# EAGLE design uStar (EAGLE 9.6.2)

## Sheet 1 of 3: Connections
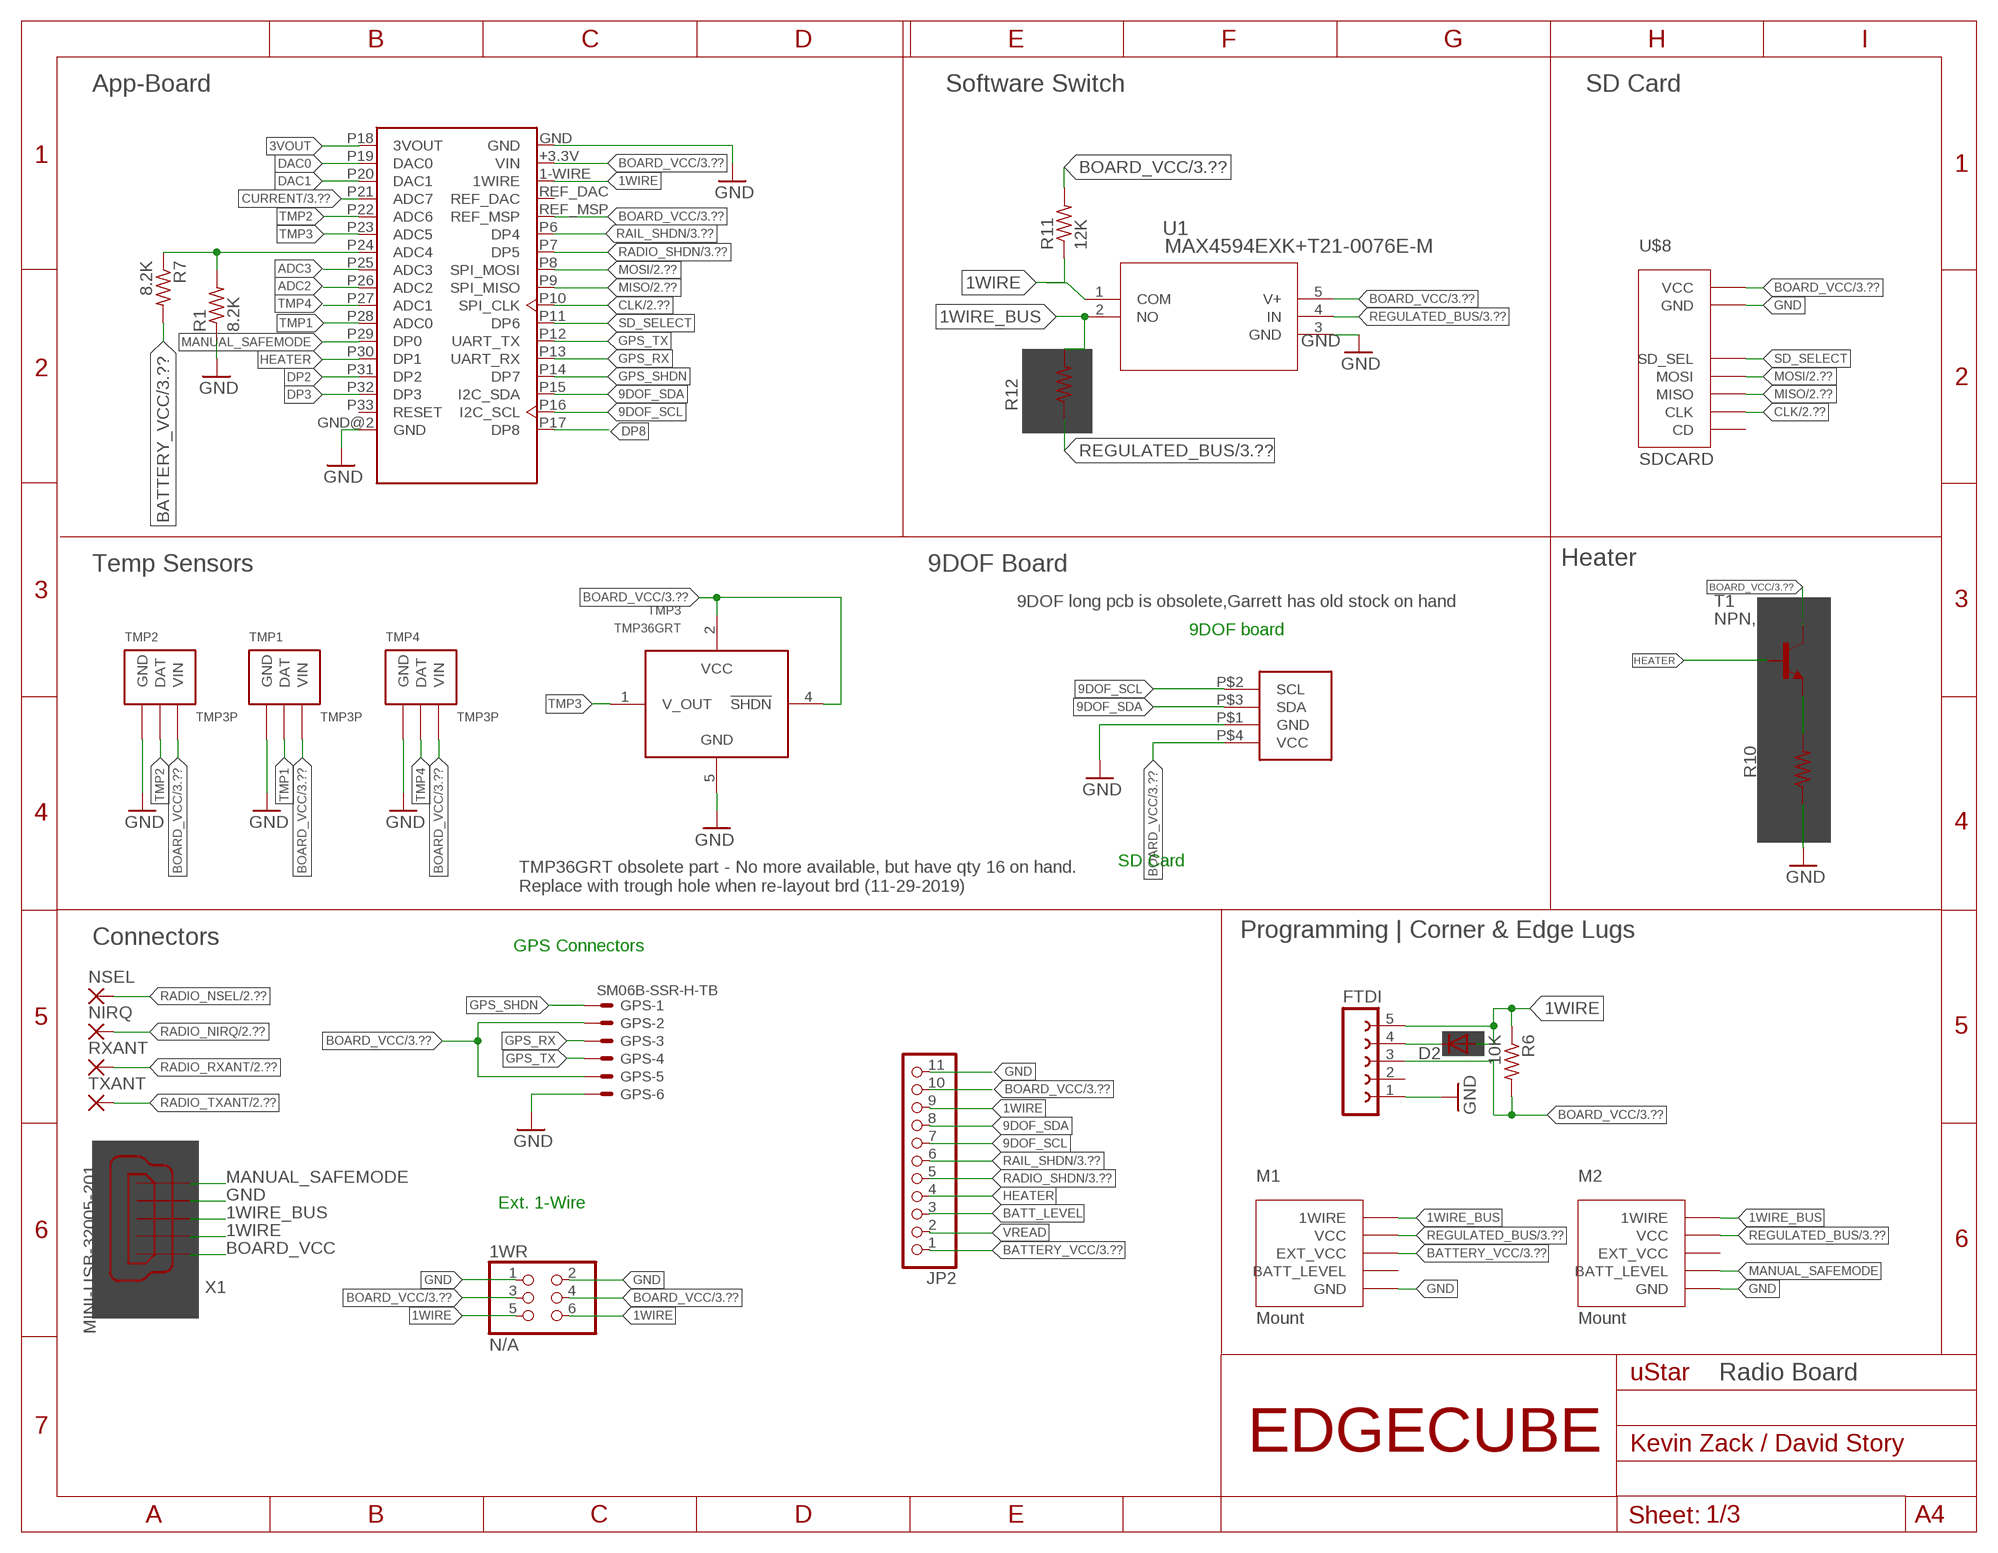
[diagram p0: schematic, sheet 1]
FRAME2 (SSEL_SHEET_A3): AUTHOR: Kevin Zack / David Story; SHEET_NAME: Connections

### Parts
1WR  N/A  PINHD-2X3  [2X03]
D2  D-B260A  [SMA-DO214AC]
FTDI  FE05-1  [FE05-1]
GPS  SM06B-SSR-H-TB  [SM06B-SSR-H-TB]
JP2  PINHD-1X11  [1X11]
M1  Mount  4X8MOUNT  [4X8MOUNT]
M2  Mount  4X8MOUNT  [4X8MOUNT]
NIRQ  1,6/0,9  [1,6/0,9]
NSEL  1,6/0,9  [1,6/0,9]
PCB1  9DOF  [9DOF]
R1  8.2K  R-US_R0805  [R0805]
R6  10K  RES-0603-10K  [R0603]
R7  8.2K  R-US_R0805  [R0805]
R10  22  R-US_0207/7  [0207/7]
R11  12K  R-US_R0805  [R0805]
R12  NP  R-US_R0805  [R0805]
RXANT  1,6/0,9  [1,6/0,9]
T1  NPN, 0.25A  2N2222  [TO92-EBC-OVAL]
TMP1  TMP3P  [TMP3P]
TMP2  TMP3P  [TMP3P]
TMP3  TMP36GRT  [SOT-23-5]
TMP4  TMP3P  [TMP3P]
TXANT  1,6/0,9  [1,6/0,9]
U1  MAX4594EXK+T21-0076E-M  [21-0076E-M]
U$1  App-Board 1.2/1.3  APP_CORE  [APPCORE_RECEIVER]
U$8  SDCARD  [SDCARD]
X1  MINI-USB-32005-201  [32005-201]

### Nets
1WIRE: 1WR.5 1WR.6 D2.A FTDI.5 JP2.9 R6.1 R11.1 U1.1(COM) U$1.1-WIRE(1WIRE) X1.2
1WIRE_BUS: M1.P$2(1WIRE) M1.P$5(1WIRE) M2.P$2(1WIRE) M2.P$5(1WIRE) R12.2 U1.2(NO) X1.3
3VOUT: U$1.P18(3VOUT)
9DOF_SCL: JP2.7 PCB1.P$2(SCL) U$1.P16(I2C_SCL)
9DOF_SDA: JP2.8 PCB1.P$3(SDA) U$1.P15(I2C_SDA)
ADC2: U$1.P26(ADC2)
ADC3: U$1.P25(ADC3)
BATT_LEVEL: JP2.3
BATTERY_VCC: JP2.1 M1.P$3(EXT_VCC) R7.2 ; also sheet 3
BOARD_VCC: 1WR.3 1WR.4 FTDI.3 GPS.2 GPS.5 JP2.10 PCB1.P$4(VCC) R6.2 R11.2 T1.C TMP1.P$3(VIN) TMP2.P$3(VIN) TMP3.2(VCC) TMP3.4(!SHDN) TMP4.P$3(VIN) U1.5(V+) U$1.+3.3V(VIN) U$1.REF_MSP U$8.P$3(VCC) X1.1 ; also sheet 3
CLK: U$1.P10(SPI_CLK) U$8.P$4(CLK) ; also sheet 2
CURRENT: U$1.P21(ADC7) ; also sheet 3
DAC0: U$1.P19(DAC0)
DAC1: U$1.P20(DAC1)
DP2: U$1.P31(DP2)
DP3: U$1.P32(DP3)
DP8: U$1.P17(DP8)
GND: 1WR.1 1WR.2 FTDI.1 GPS.6 JP2.11 M1.P$1(GND) M1.P$8(GND) M2.P$1(GND) M2.P$8(GND) PCB1.P$1(GND) R1.1 R10.1 TMP1.P$1(GND) TMP2.P$1(GND) TMP3.5(GND) TMP4.P$1(GND) U1.3(GND) U$1.GND U$1.GND@2(GND) U$8.P$5(GND) X1.4 ; also sheet 2,3
GPS_RX: GPS.3 U$1.P13(UART_RX)
GPS_SHDN: GPS.1 U$1.P14(DP7)
GPS_TX: GPS.4 U$1.P12(UART_TX)
HEATER: JP2.4 T1.B U$1.P30(DP1)
MANUAL_SAFEMODE: M2.P$6(BATT_LEVEL) U$1.P29(DP0) X1.5
MISO: U$1.P9(SPI_MISO) U$8.P$6(MISO) ; also sheet 2
MOSI: U$1.P8(SPI_MOSI) U$8.P$2(MOSI) ; also sheet 2
N$1: R1.2 R7.1 U$1.P24(ADC4)
N$2: R10.2 T1.E
N$3: D2.K(C) FTDI.4
N$7: U$1.P33(RESET)
RADIO_NIRQ: NIRQ.1(P) ; also sheet 2
RADIO_NSEL: NSEL.1(P) ; also sheet 2
RADIO_RXANT: RXANT.1(P) ; also sheet 2
RADIO_SHDN: JP2.5 U$1.P7(DP5) ; also sheet 3
RADIO_TXANT: TXANT.1(P) ; also sheet 2
RAIL_SHDN: JP2.6 U$1.P6(DP4) ; also sheet 3
REGULATED_BUS: M1.P$4(VCC) M1.P$7(VCC) M2.P$4(VCC) M2.P$7(VCC) R12.1 U1.4(IN) ; also sheet 3
SD_SELECT: U$1.P11(DP6) U$8.P$1(SD_SEL)
TMP1: TMP1.P$2(DAT) U$1.P28(ADC0)
TMP2: TMP2.P$2(DAT) U$1.P22(ADC6)
TMP3: TMP3.1(V_OUT) U$1.P23(ADC5)
TMP4: TMP4.P$2(DAT) U$1.P27(ADC1)
VREAD: JP2.2
Unconnected: FTDI.2 M1.P$6(BATT_LEVEL) M2.P$3(EXT_VCC) U$1.REF_DAC U$8.P$7(CD)

### Notes on the sheet
- App-Board | Software Switch | SD Card
- Temp Sensors | 9DOF Board | Heater
- 9DOF long pcb is obsolete,Garrett has old stock on hand
- 9DOF board
- SD Card
- TMP36GRT obsolete part - No more available, but have qty 16 on hand.
  Replace with trough hole when re-layout brd (11-29-2019)
- Connectors | Programming | Corner & Edge Lugs
- GPS Connectors
- Ext. 1-Wire
- Radio Board

## Sheet 2 of 3: Radio
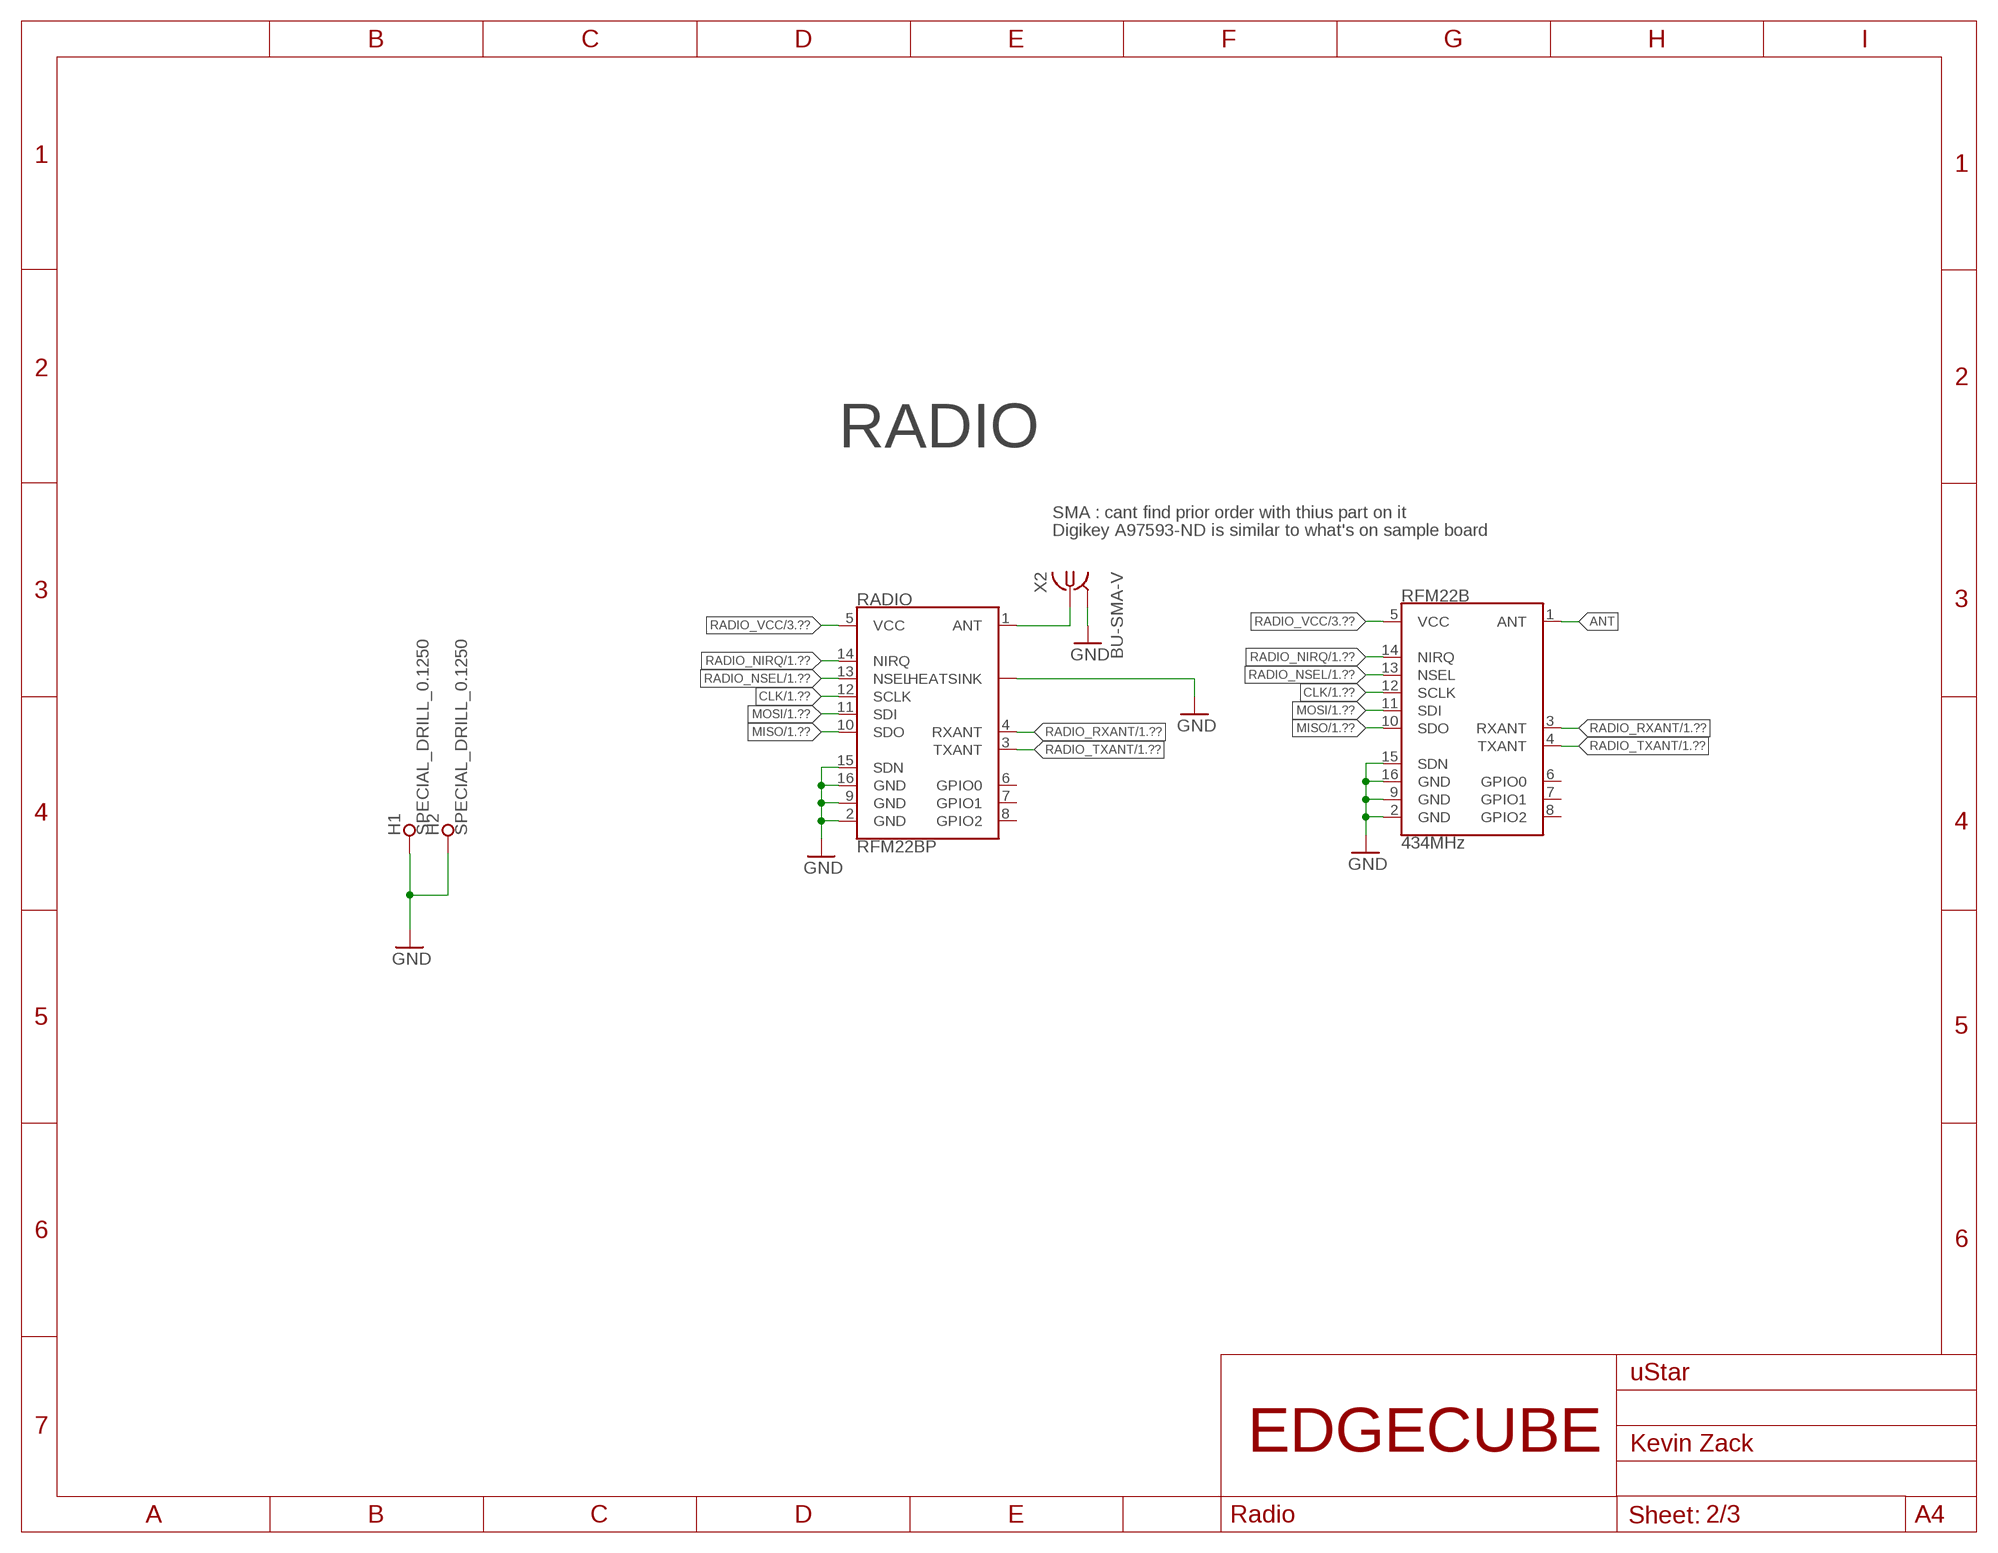
[diagram p1: schematic, sheet 2]
FRAME1 (SSEL_SHEET_A3): AUTHOR: Kevin Zack; SHEET_NAME: Radio

### Parts
H1  SPECIAL_DRILL_0.1250  [PAD_0.1250]
H2  SPECIAL_DRILL_0.1250  [PAD_0.1250]
RADIO  RFM22BP  [RFM22BP]
RFM22B  434MHz  RFM22434MHZ  [RFM22-XXX-S2]
X2  BU-SMA-V  [BU-SMA-V]

### Nets
ANT: RADIO.1(ANT) RFM22B.1(ANT) X2.1
CLK: RADIO.12(SCLK) RFM22B.12(SCLK) ; also sheet 1
GND: H1.1 H2.1 RADIO.2(GND) RADIO.9(GND) RADIO.15(SDN) RADIO.16(GND) RADIO.P$1(HEATSINK) RFM22B.2(GND) RFM22B.9(GND) RFM22B.15(SDN) RFM22B.16(GND) X2.2 X2.3 X2.4 X2.5 ; also sheet 1,3
MISO: RADIO.10(SDO) RFM22B.10(SDO) ; also sheet 1
MOSI: RADIO.11(SDI) RFM22B.11(SDI) ; also sheet 1
RADIO_NIRQ: RADIO.14(NIRQ) RFM22B.14(NIRQ) ; also sheet 1
RADIO_NSEL: RADIO.13(NSEL) RFM22B.13(NSEL) ; also sheet 1
RADIO_RXANT: RADIO.4(RXANT) RFM22B.3(RXANT) ; also sheet 1
RADIO_TXANT: RADIO.3(TXANT) RFM22B.4(TXANT) ; also sheet 1
RADIO_VCC: RADIO.5(VCC) RFM22B.5(VCC) ; also sheet 3
Unconnected: RADIO.6(GPIO0) RADIO.7(GPIO1) RADIO.8(GPIO2) RFM22B.6(GPIO0) RFM22B.7(GPIO1) RFM22B.8(GPIO2)

### Notes on the sheet
- RADIO
- SMA : cant find prior order with thius part on it
- Digikey A97593-ND is similar to what's on sample board

## Sheet 3 of 3: Power
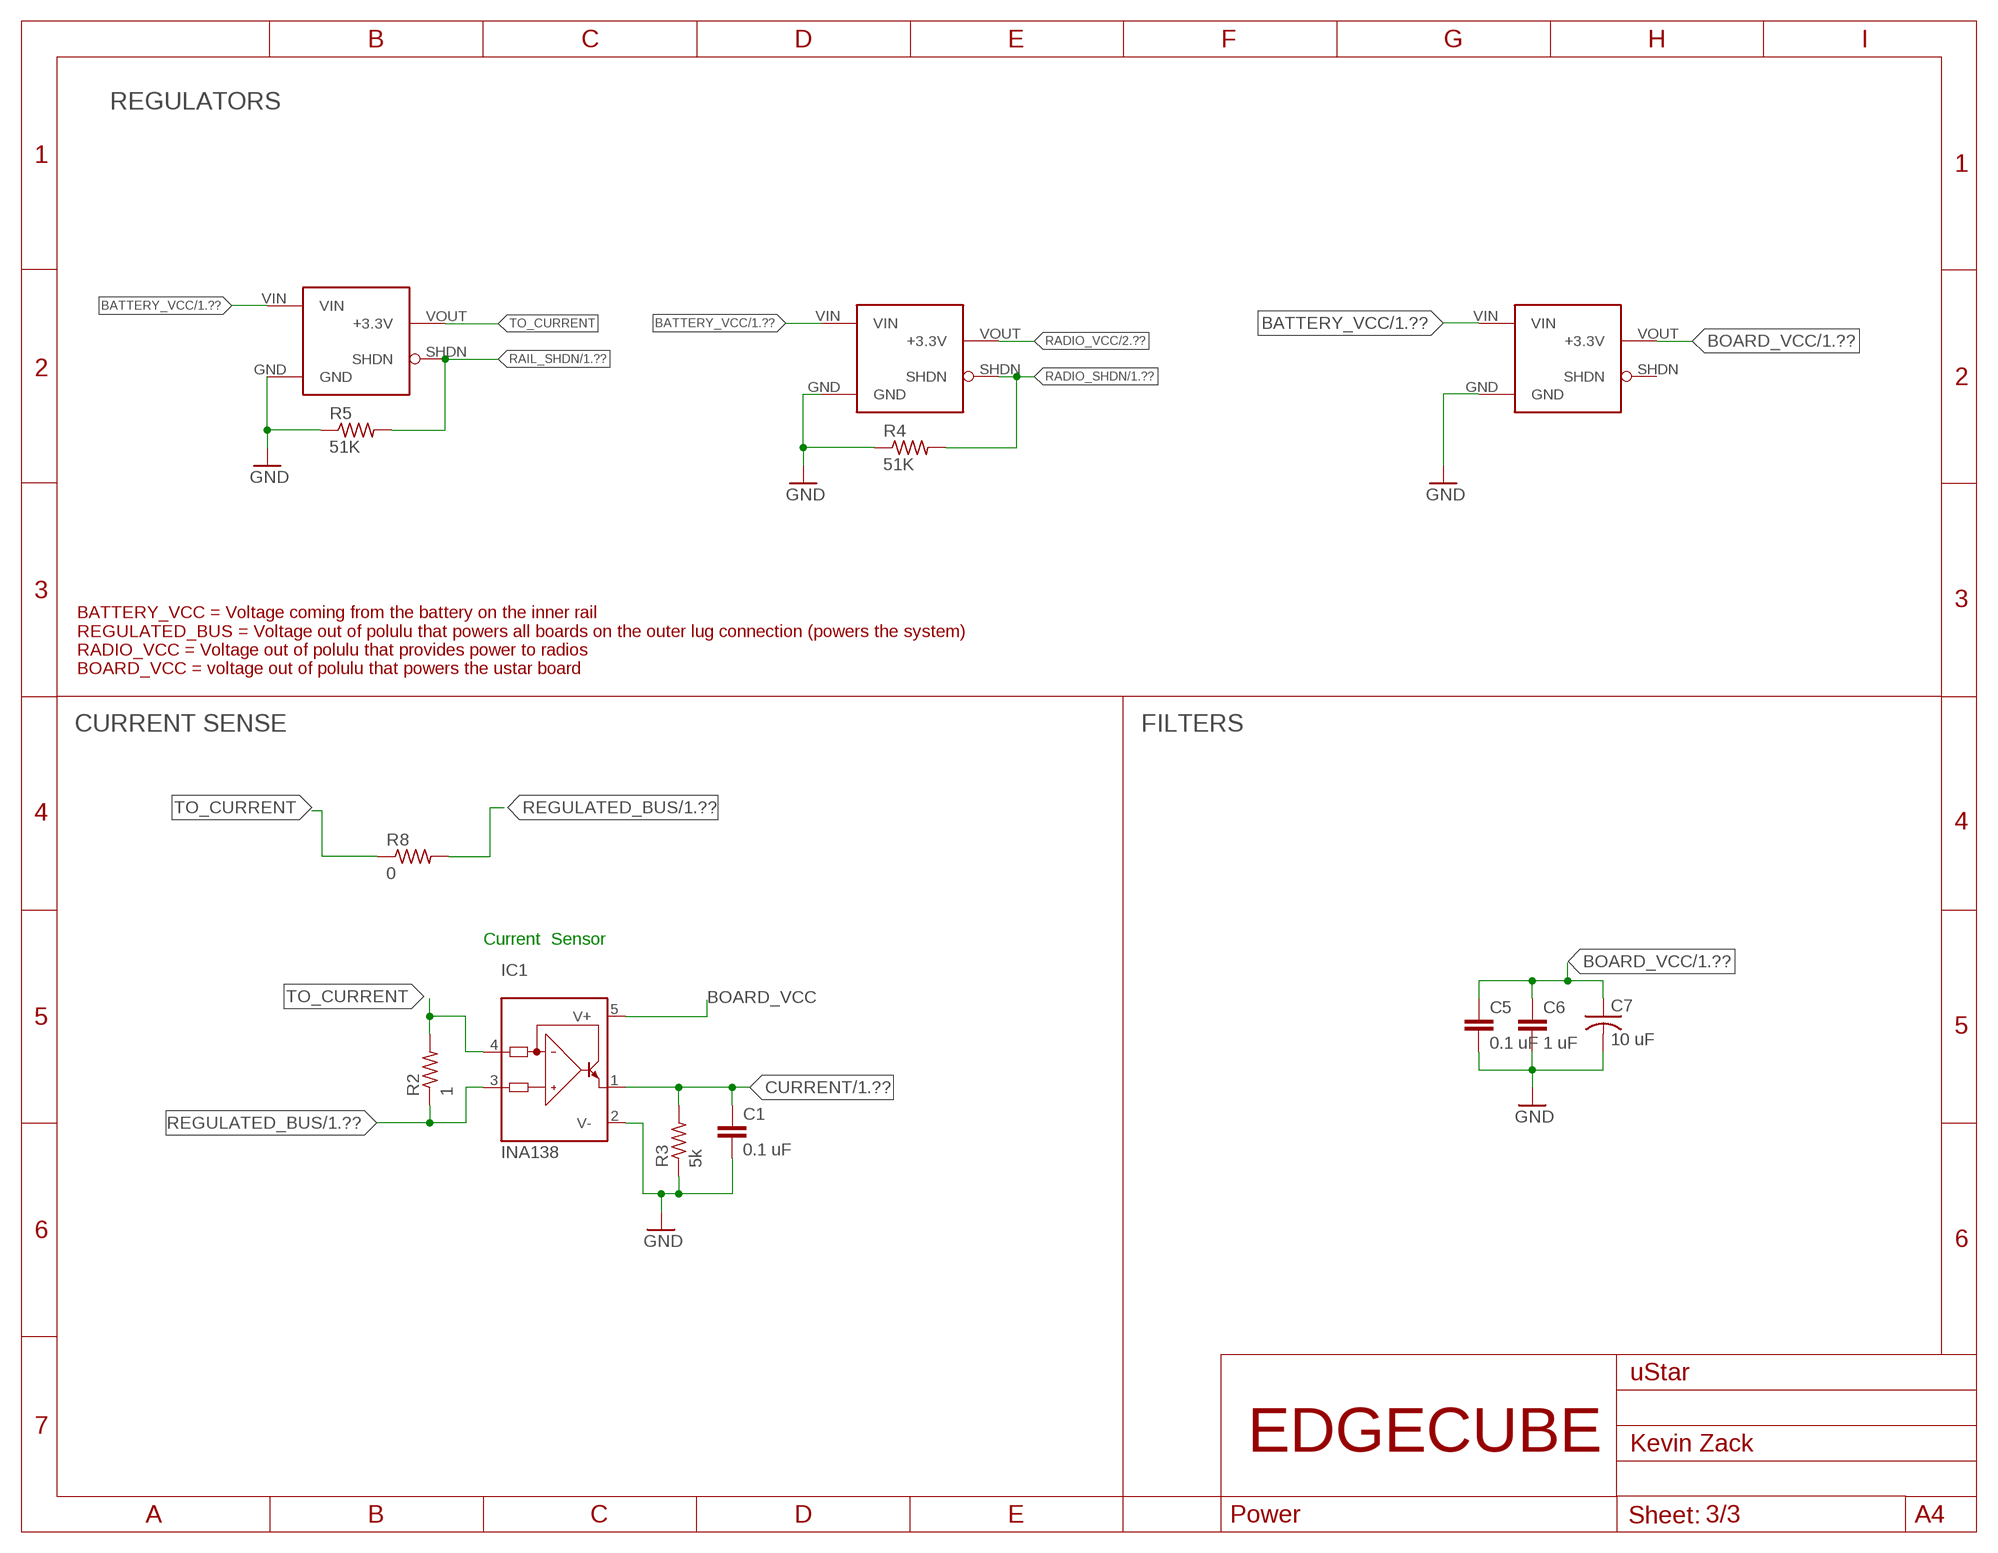
[diagram p2: schematic, sheet 3]
FRAME3 (SSEL_SHEET_A3): AUTHOR: Kevin Zack; SHEET_NAME: Power

### Parts
C1  0.1 uF  CAP-0603-0.1UF  [C0603]
C5  0.1 uF  CAP-0603-0.1UF  [C0603]
C6  1 uF  CAP-0603-1UF  [C0603]
C7  10 uF  CAP-0805-10UF-TANT  [C0805_POL]
IC1  INA138  [SOT23-5]
R2  1  R-US_R0603  [R0603]
R3  5k  R-US_R0603  [R0603]
R4  51K  RES-0603-51K  [R0603]
R5  51K  RES-0603-51K  [R0603]
R8  0  R-US_R1210W  [R1210W]
VR1  S7V8F3_VOLT_REG-3V3_1AHORZ-DOWN  [S7V_DOWN]
VR2  S7V8F3_VOLT_REG-3V3_1AHORZ-DOWN  [S7V_DOWN]
VR3  S7V8F3_VOLT_REG-3V3_1AHORZ-DOWN  [S7V_DOWN]

### Nets
BATTERY_VCC: VR1.VIN VR2.VIN VR3.VIN ; also sheet 1
BOARD_VCC: C5.1 C6.1 C7.2 IC1.5(V+) VR3.VOUT(+3.3V) ; also sheet 1
CURRENT: C1.1 IC1.1(OUT) R3.2 ; also sheet 1
GND: C1.2 C5.2 C6.2 C7.1 IC1.2(V-) R3.1 R4.1 R5.1 VR1.GND VR2.GND VR3.GND ; also sheet 1,2
RADIO_SHDN: R4.2 VR2.SHDN ; also sheet 1
RADIO_VCC: VR2.VOUT(+3.3V) ; also sheet 2
RAIL_SHDN: R5.2 VR1.SHDN ; also sheet 1
REGULATED_BUS: IC1.3(IN+) R2.1 R8.2 ; also sheet 1
TO_CURRENT: IC1.4(IN-) R2.2 R8.1 VR1.VOUT(+3.3V)
Unconnected: VR3.SHDN

### Notes on the sheet
- REGULATORS
- BATTERY_VCC = Voltage coming from the battery on the inner rail
  REGULATED_BUS = Voltage out of polulu that powers all boards on the outer lug connection (powers the system)
  RADIO_VCC = Voltage out of polulu that provides power to radios
  BOARD_VCC = voltage out of polulu that powers the ustar board
- CURRENT SENSE | FILTERS
- Current  Sensor

## Library data of the parts
1WR = pinhead:PINHD-2X3: PIN HEADER
C1 C5 = SSEL_RLC:CAP-0603-0.1UF: CAP CER 0.1UF 50V X7R 0603; DIGIKEY: 478-5052-1-ND; HEIGHT: 35 MIL; MANF-PN: 06035C104KAT2A; MANUFACTURER: AVX Corperation; PACKAGE: 0603; VOLTAGE: 50 V
C6 = SSEL_RLC:CAP-0603-1UF: CAP CER 0.1UF 50V X7R 0603; DIGIKEY: 587-2984-1-ND; HEIGHT: 35 MIL; MANF-PN: TMK107B7105KA-T; MANUFACTURER: Taiyo Yuden; PACKAGE: 0603; VALUE: 0.1 uF; VOLTAGE: 25 V
C7 = SSEL_RLC:CAP-0805-10UF-TANT: CAP TANT 10UF 10V X5R 0805; DIGIKEY: 478-3281-1-ND; MANF-PN: TAJP106M010RNJ; MANUFACTURE: AVX Corporation; PACKAGE: 0805; VOLTAGE: 10 V
D2 = SSEL_DIODE:D-B260A: DIODE SCHOTTKY 60V 2A SMA Datasheet <https://www.diodes.com/assets/Datasheets/ds13004.pdf>; CURRENT: 2A; DIGIKEY: B260A-FDICT-ND; HEIGHT: 91; MANF-PN: B260A-13-F; MANUFACTURER: Diodes Incorporated; NOTLOADED: NOTLOADED; PACKAGE: SMA; VOLTAGE: 60V
FTDI = con-lsta:FE05-1: FEMALE HEADER; OC_FARNELL: unknown; OC_NEWARK: unknown
GPS = con-jst2:SM06B-SSR-H-TB: Disconnectable Insulation displacement connector, 1.0mm pitch 6 contacts
H1 H2 = special-drill:SPECIAL_DRILL_: Special drills
IC1 = burr-brown:INA138: High-Side Measurement Current Shunt Monitor; MF: TEXAS INSTRUMENTS; MOUSER: 595-INA138NA3K; MPN: INA138NA/250; OC_FARNELL: 1564888; OC_NEWARK: 80K5906
JP2 = pinhead:PINHD-1X11: PIN HEADER
M1 M2 = EDGEQUBE_MISC:4X8MOUNT: 4x8 MOUNT for EDGEQUBE
NIRQ NSEL RXANT TXANT = wirepad:1,6/0,9: THROUGH-HOLE PAD
PCB1 = LearningByMaking:9DOF; SPARKFUN: obsolete
R1 R7 = resistor:R-US_: RESISTOR, American symbol
R2 = resistor:R-US_: RESISTOR, American symbol; DIGIKEY: 311-1.00HRCT-ND; MOUSER: 603-RC0201JR-071RL
R3 = resistor:R-US_: RESISTOR, American symbol; DIGIKEY: 2019-RK73B1JTTD512JCT-ND
R4 R5 = SSEL_RLC:RES-0603-51K: RES SMD 51K OHM 1% 1/10W 0603; DIGIKEY: 541-51.0KHCT-ND; HEIGHT: 20 MIL; MANF-PN: CRCW060351K0FKEA; MANUFACTURER: Vishay Dale; PACKAGE: 0603; POWER: 0.1W
R6 = SSEL_RLC:RES-0603-10K: RES SMD 10K OHM 1% 1/10W 0603; DIGIKEY: 541-10.0KHCT-ND; HEIGHT: 20 MIL; MANF-PN: CRCW060310K0FKEA; MANUFACTURER: Vishay Dale; PACKAGE: 0603; POWER: 0.1W
R8 = rcl:R-US_: RESISTOR, American symbol; DIGIKEY: YAG3375CT-ND; SPICEPREFIX: R
R10 R12 = rcl:R-US_: RESISTOR, American symbol; NOTLOADED: NOTLOADED; SPICEPREFIX: R
R11 = rcl:R-US_: RESISTOR, American symbol; SPICEPREFIX: R
RADIO = EDGEQUBE_PACKAGES:RFM22BP: RFM22BP 1W 433MHz Transceiver Datasheet <http://www.hoperf.com/upload/rf/RFM23BP.pdf>; FREQUENCY: 433 MHz; HEIGHT: 78 MIL; MANF-PN: RFM22BP; MANUFACTURER: HOPERF Electronic
RFM22B = SparkFun-RF:RFM22: Hope RF RFM22 ISM Transciever Module The RFM22 is a low-power, low cost radio that is capable of operating in the 434MHz and 900MHz open bands. It's frequency is software defined and there are some very good libraries written for it. SparkFun Products SparkFun RFM22 Shield - 434MHz <https://www.sparkfun.com/products/11018> (DEV-11018); PROD_ID: IC-10007; SF_ID: WRL-10153
T1 = adafruit:2N2222: NPN TRANSISTOR Big oval pads; NOTLOADED: Not Loaded
TMP1 TMP2 TMP4 = SSEL_MISC:TMP3P: TMP Sensor Wire Connection
TMP3 = SSEL_IC:TMP36GRT: SENSOR TEMP ANLG VOLT SOT-23-5 Datasheet <http://www.analog.com/media/en/technical-documentation/data-sheets/TMP35_36_37.pdf>; DIGIKEY: obsolete; HEIGHT: 68.8 MIL; MANF-PN: TMP36GRT-REEL7; MANUFACTURER: Analog Devices Inc.; PACKAGE: SOT-23-5; VOLTAGE: 2.7V-5.5V
U1 = EdgeCubeAnalogSwitch:MAX4594EXK+T; DIGIKEY: MAX4594EXK+TCT-ND; MANUFACTURER_PART_NUMBER: MAX4594EXK+T; VENDOR: Maxim Integrated Products
U$1 = LearningByMaking2:APP_CORE
U$8 = EDGEQUBE_PACKAGES:SDCARD: SD CARD Daugher Board; DIGIKEY: 1568-1345-ND; SPARKFUN: BOB-00544
VR1-VR3 = Pololu:S7V8F3_VOLT_REG-3V3_1A; DIGIKEY: 2183-2122-ND
X1 = con-cypressindustries:MINI-USB-: MINI USB-B Conector Source: www.cypressindustries.com; NOTLOADED: NOTLOADED; OC_FARNELL: unknown; OC_NEWARK: unknown
X2 = con-coax:BU-SMA-V: FEMALE SMA CONNECTOR Radiall distributor RS 112-3794; DIGIKEY: A97593-ND; OC_FARNELL: unknown; OC_NEWARK: unknown

## Board
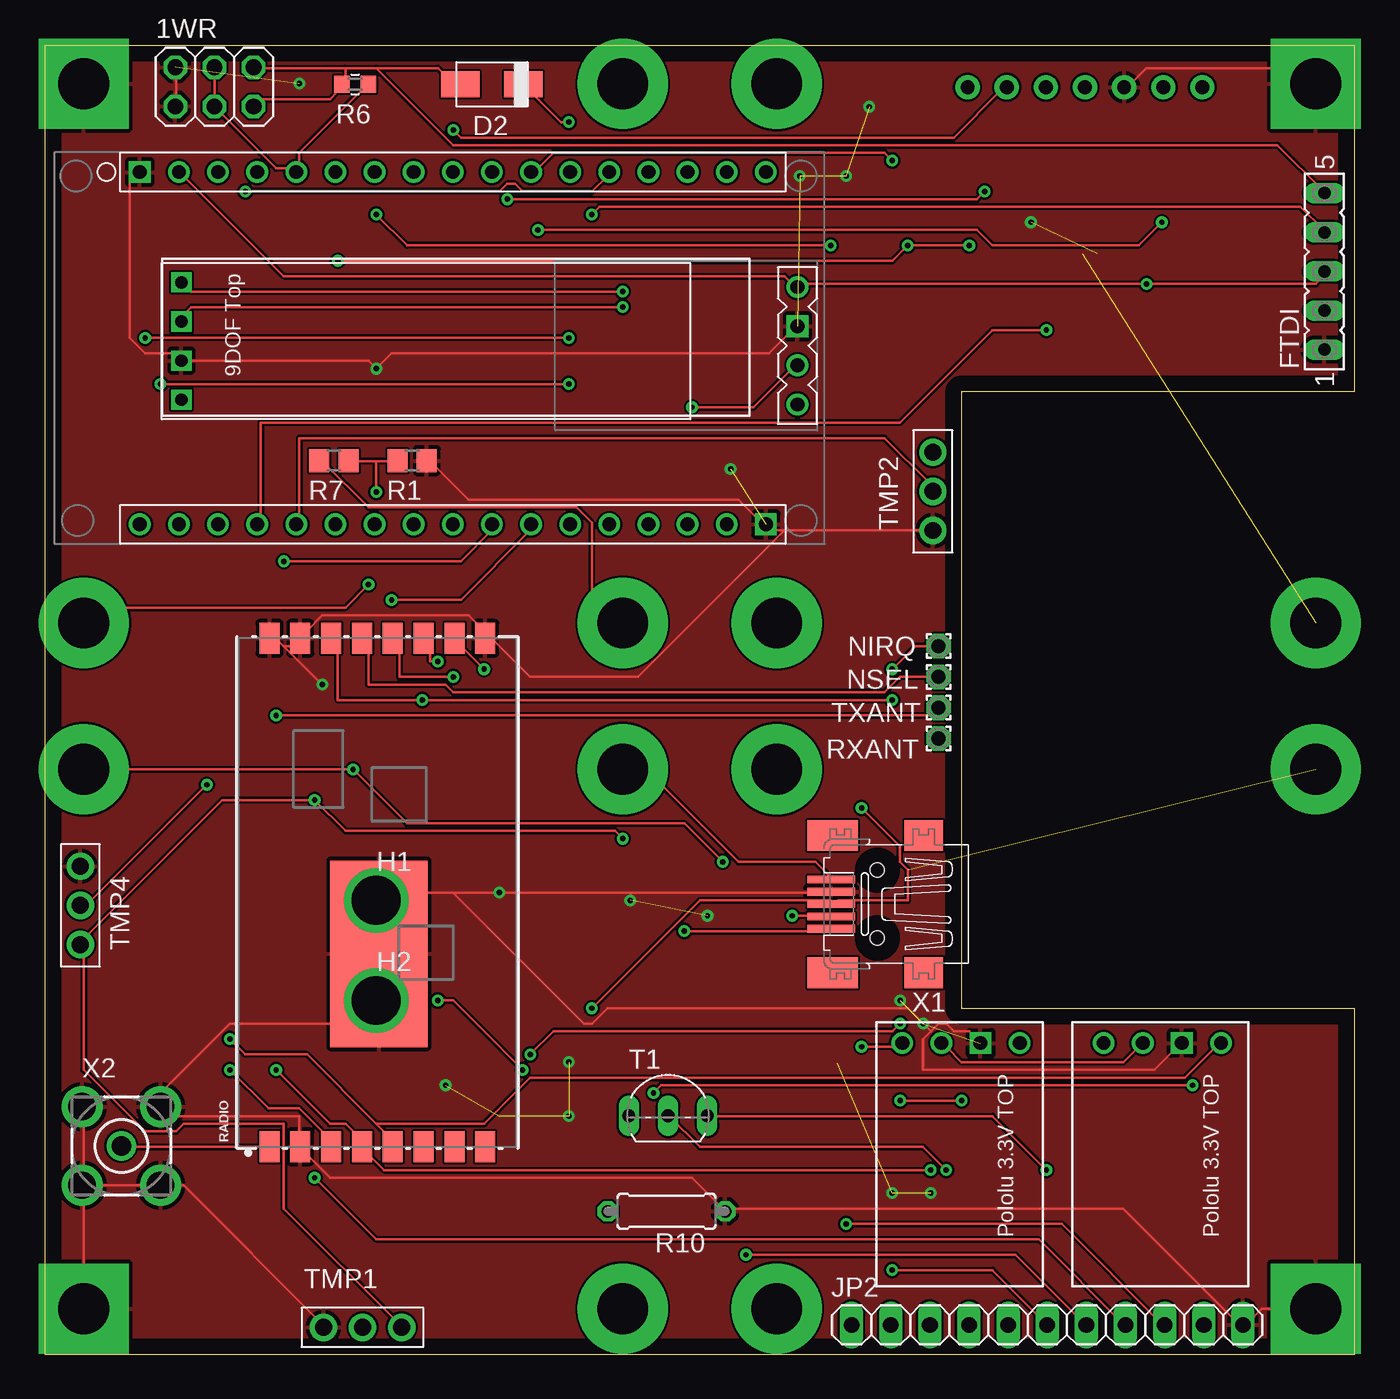
[diagram p3: board, top side]
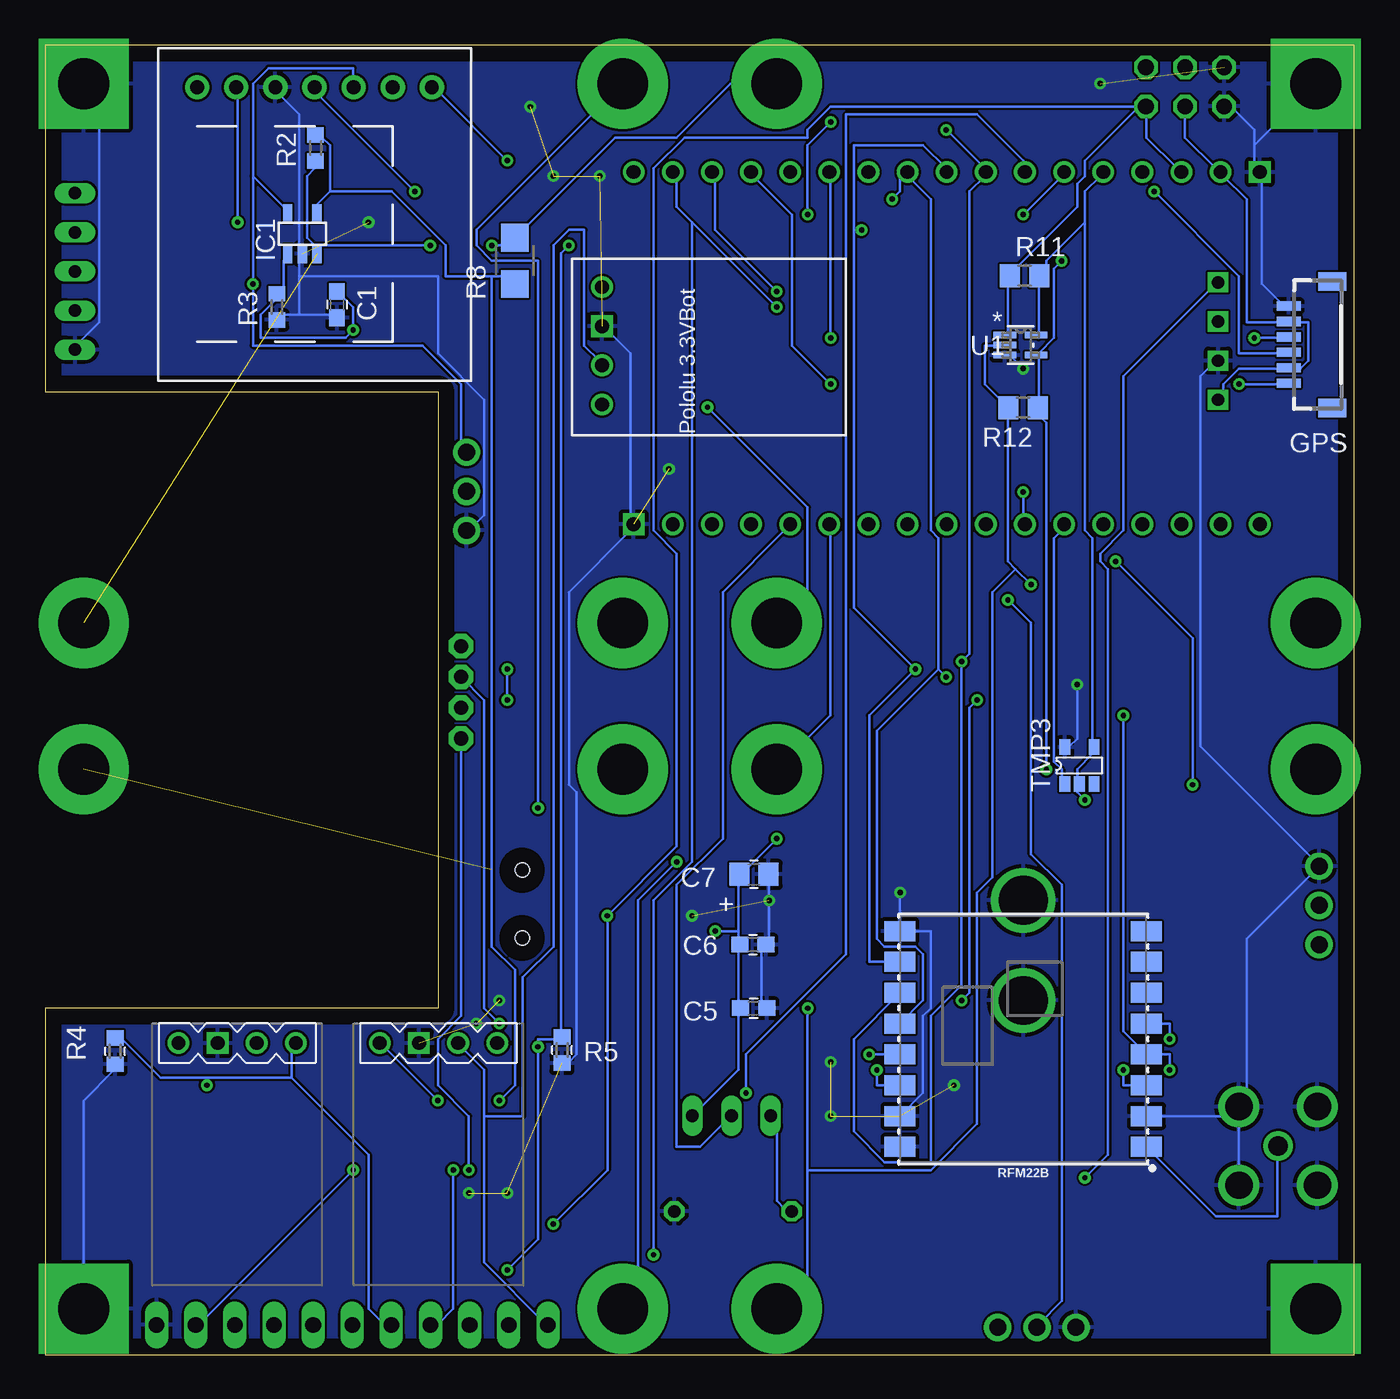
[diagram p4: board, bottom side, seen from below]

Size 85 x 85 mm. Coordinates in mm from the lower left corner, seen from the top.
Outline: 0,0 0,85 85,85 85,62.5 59.5,62.5 59.5,22.5 85,22.5 85,0 0,0
Copper layers (1*16): Top 0.035mm / dielectric 1.5mm / Bottom 0.035mm
Design rules "default": minimum track width 6mil, minimum drill 0.35mm, track to track 6mil, track to pad 6mil, pad to pad 6mil, via to via 6mil, smd to smd 6mil, copper to edge 40mil, drill to drill 6mil, minimum pad ring 10mil, minimum via ring 8mil, stop-mask expansion 4mil, vias tented up to drill 0mil, thermal gap 10mil

### Footprints (pad centres in the part's own frame; a part is rotated, then mirrored left to right if it is on the bottom)
2X03 = drill 1.016 octagon: 1 -2.54,-1.27; 2 -2.54,1.27; 3 0,-1.27; 4 0,1.27; 5 2.54,-1.27; 6 2.54,1.27
C0603 = smd 1.1 x 1: 1 -0.85,0; 2 0.85,0
C0805_POL = smd 1.3 x 1.5: 1 -0.95,0; 2 0.95,0
SMA-DO214AC = smd 2.5 x 1.7: A -2.05,0; K 2.05,0
FE05-1 = drill 0.813 long: 1 -5.08,0; 2 -2.54,0; 3 0,0; 4 2.54,0; 5 5.08,0
SM06B-SSR-H-TB = smd 0.6 x 1.55: 1 -2.5,1.925; 2 -1.5,1.925; 3 -0.5,1.925; 4 0.5,1.925; 5 1.5,1.925; 6 2.5,1.925 | smd 1.2 x 1.8: FIT@1 -4.1,-0.9; FIT@2 4.1,-0.9
PAD_0.1250 = drill 3.175 pad 3.175: 1 0,0
SOT23-5 = smd 0.6 x 1.2: 1 -0.95,-1.306; 2 0,-1.306; 3 0.95,-1.306; 4 0.95,1.306; 5 -0.95,1.306
1X11 = drill 1.016 long: 1 -12.7,0; 2 -10.16,0; 3 -7.62,0; 4 -5.08,0; 5 -2.54,0; 6 0,0; 7 2.54,0; 8 5.08,0; 9 7.62,0; 10 10.16,0; 11 12.7,0
4X8MOUNT = drill 3.3 pad 5.85 square: P$1 2.5,37.5; P$8 82.5,37.5 | drill 3.3 pad 5.85: P$2 2.502,2.5; P$3 37.5,2.5; P$4 37.5,37.5; P$5 47.5,37.5; P$6 47.5,2.5; P$7 82.5,2.5
1,6/0,9 = drill 0.914 pad 1.6 octagon: 1 0,0
9DOF = drill 0.8 square: P$1 0,-1.27; P$2 0,1.27; P$3 0,3.81; P$4 0,-3.81
R0805 = smd 1.3 x 1.5: 1 -0.95,0; 2 0.95,0
R0603 = smd 1 x 1.1: 1 -0.85,0; 2 0.85,0
R1210W = smd 1.8 x 1.8: 1 -1.499,0; 2 1.499,0
0207/7 = drill 0.813 octagon: 1 -3.81,0; 2 3.81,0
RFM22BP = smd 2 x 1.3: 1 0,14; 2 0,12; 3 0,10; 4 0,8; 5 0,6; 6 0,4; 7 0,2; 8 0,0; 9 33,0; 10 33,2; 11 33,4; 12 33,6; 13 33,8; 14 33,10; 15 33,12; 16 33,14 | smd 12.1 x 6.3: P$1 12.52,6.9
RFM22-XXX-S2 = smd 2 x 1.3: 1 -8,7; 2 -8,5; 3 -8,3; 4 -8,1; 5 -8,-1; 6 -8,-3; 7 -8,-5; 8 -8,-7; 9 8,-7; 10 8,-5; 11 8,-3; 12 8,-1; 13 8,1; 14 8,3; 15 8,5; 16 8,7
TO92-EBC-OVAL = drill 0.813 long: B 0,-1.27; C 2.54,-1.27; E -2.54,-1.27
TMP3P = drill 1.1 pad 1.778: P$1 0,0; P$2 2.54,0; P$3 5.08,0
SOT-23-5 = smd 0.7 x 1: 1 -0.95,-1.2; 2 0,-1.2; 3 0.95,-1.2; 4 0.95,1.2; 5 -0.95,1.2
21-0076E-M = smd 1.473 x 0.406: 1 -1.016,0.65; 2 -1.016,0; 3 -1.016,-0.65; 4 1.016,-0.65; 5 1.016,0.65
APPCORE_RECEIVER = drill 0.9: 1-WIRE 11.43,14.37; +3.3V 11.43,16.91; P6 11.43,6.75; P7 11.43,4.21; P8 11.43,1.67; P9 11.43,-0.87; P10 11.43,-3.41; P11 11.43,-5.95; P12 11.43,-8.49; P13 11.43,-11.03; P14 11.43,-13.57; P15 11.43,-16.11; P16 11.43,-18.65; P17 11.43,-21.19; P18 -11.43,19.45; P19 -11.43,16.91; P20 -11.43,14.37; P21 -11.43,11.83; P22 -11.43,9.29; P23 -11.43,6.75; P24 -11.43,4.21; P25 -11.43,1.67; P26 -11.43,-0.87; P27 -11.43,-3.41; P28 -11.43,-5.95; P29 -11.43,-8.49; P30 -11.43,-11.03; P31 -11.43,-13.57; P32 -11.43,-16.11; P33 -11.43,-18.65; REF_DAC 11.43,11.83; REF_MSP 11.43,9.29 | drill 0.9 square: GND 11.43,19.45; GND@2 -11.43,-21.19
SDCARD = drill 0.9 pad 1.575: P$1 0,0; P$2 2.54,0; P$3 5.08,0; P$4 7.62,0; P$5 10.16,0; P$6 12.7,0; P$7 15.24,0
S7V_DOWN = drill 0.9 square: GND 1.27,-7.23 | drill 0.9: SHDN -3.81,-7.23; VIN -1.27,-7.23; VOUT 3.81,-7.23
32005-201 = smd 3.1 x 0.5: 1 3,1.6; 2 3,0.8; 3 3,0; 4 3,-0.8; 5 3,-1.6 | smd 2.5 x 2: M1 -3,-4.45; M2 -3,4.45 | smd 3.3 x 2: M3 2.9,4.45; M4 2.9,-4.45 | hole 0.9: 0,2.2; 0,-2.2
BU-SMA-V = drill 1.27: 1 0,0 | drill 1.778: 2 -2.55,2.55; 3 2.55,2.55; 4 2.55,-2.55; 5 -2.55,-2.55

### Placement (x,y rotation side)
1WR  11,82.29 0 top
C1  66.05,68.16 270 bottom
C5  39,22.5 0 bottom
C6  39.05,26.63 0 bottom
C7  38.98,31.18 180 bottom
D2  29.01,82.45 0 top
FTDI  83.05,70.31 90 top
GPS  2.34,65.56 90 bottom
H1  21.5,29.5 0 top
H2  21.5,23 0 top
IC1  68.3,72.75 0 bottom
JP2  65.06,1.95 0 top
M1  0,45 0 top
M2  85,40.5 180 top
NIRQ  58,46 270 top
NSEL  58,44 270 top
PCB1  8.85,65.79 0 top
R1  23.83,58.03 180 top
R2  67.45,78.32 90 bottom
R3  69.95,68.01 90 bottom
R4  80.45,19.71 90 bottom
R5  51.45,19.79 90 bottom
R6  20.13,82.45 0 top
R7  18.75,58.03 180 top
R8  54.5,71 90 bottom
R10  40.34,9.32 180 top
R11  21.41,70.03 0 bottom
R12  21.51,61.47 180 bottom
RADIO  28.57,13.51 90 top
RFM22B  21.5,20.5 180 bottom
RXANT  58,40 270 top
T1  40.44,16.79 0 top
TMP1  18.07,1.79 0 top
TMP2  57.63,53.5 90 top
TMP3  17.85,38.25 0 bottom
TMP4  2.29,31.71 270 top
TXANT  58,42 270 top
U1  21.67,65.53 0 bottom
U$1  25.6,65.33 90 top
U$8  59.89,82.26 0 top
VR1  59.46,13.01 180 bottom
VR2  72.53,13.01 180 bottom
VR3  41.61,65.49 90 top
X1  54.03,29.26 180 top
X2  4.95,13.56 0 top

### Tracks (layer width: path | path; a pad name or v marks a point on that pad's centre or on a via)
1WIRE  (via drill 0.35)
  Top 0.152: v52,8.5 66,8.5 72.5,2 JP2.9 | v48.5,28.5 51,28.5 X1.2 | 1WR.5 14,81.5 18.5,81.5 19,82 R6.1 19.5,82.5 19.5,83.5 | 19.5,83.5 14,83.5 1WR.6 | 19.5,83.5 21.5,83.5 | 21.5,83.5 25.5,83.5 26.5,82.5 D2.A | 21.5,83.5 26.5,78.5 80,78.5 83,75.5 FTDI.5
  Bottom 0.152: v52,8.5 48.5,12 v48.5,28.5 44,33 44,52 45.5,53.5 45.5,77 43.5,79 35.5,79 35.5,79.5 34,81 14,81 | U1.1 22.5,66 22.5,70 R11.1 22,70.5 18,74.5 18,76 17.5,76.5 17.5,77.5 14,81 | U$1.1-WIRE 11.5,77 13.5,79 13.5,81 1WR.5 14,81
1WIRE_BUS  (via drill 0.35)  (1 unrouted)
  Top 0.152: v21,50 19.5,48.5 4,48.5 3,47.5 M1.P$2 | v35.5,22.5 42.5,29.5 51,29.5 X1.3 51.5,29.5 56,29.5 56,31.5 55.5,32 55.5,33 v53,35.5
  Bottom 0.152: U1.2 23,65.5 24,65.5 24,63 22.5,61.5 R12.2 22.5,61 22.5,51.5 22,51 | v21,50 22,51 | 35.5,12 35.5,5 M2.P$5 | 35.5,12 v35.5,22.5 | M1.P$5 57,73 57,72 56,71 53,71 v53,35.5 | 22,51 23.5,49.5 23.5,31 24.5,30 24.5,15 27.5,12 35.5,12
9DOF_SCL  (via drill 0.35)
  Top 0.152: v37.5,68 9.5,68 9,67.5 PCB1.P$2 | v45.5,6.5 63,6.5 67.5,2 JP2.7
  Bottom 0.152: 43,73.5 44,74.5 44,76.5 U$1.P16 | 43,73.5 v37.5,68 | v45.5,6.5 45.5,29.5 43,32 43,73.5
9DOF_SDA  (via drill 0.35)
  Top 0.152: v37.5,69 9.5,69 9,69.5 PCB1.P$3 | v17.5,11.5 21.5,7.5 64.5,7.5 70,2 JP2.8
  Bottom 0.152: v37.5,69 41.5,73 41.5,76.5 U$1.P15 | v17.5,11.5 16,13 16,51 16.5,51.5 16.5,52 15,53.5 15,63.5 9,69.5 PCB1.P$3
ANT
  Top 0.152: RADIO.1 14.5,13.5 5,13.5 X2.1
  Bottom 0.152: RFM22B.1 9,9 5,9 5,13.5 X2.1
BATTERY_VCC  (via drill 0.35)
  Top 0.152: VR1.VIN 58.5,20 59.5,19 70,19 71,20 VR2.VIN | M1.P$3 35.5,47.5 35.5,54 34.5,55 21,55 18,58 R7.2 | v42,61.5 46,61.5 48.5,64 VR3.VIN
  Bottom 0.152: 56.5,15.5 56.5,18.5 58,20 VR1.VIN | 56.5,15.5 56.5,6 52.5,2 JP2.1 | v42,61.5 35.5,55 35.5,49.5 M1.P$3 | 56.5,15.5 54,15.5 54,24.5 52,26.5 52,72 51,73 50,73 50,65.5 49,64.5 VR3.VIN
BOARD_VCC  (via drill 0.35)
  Top 0.152: v65,12 61.5,15.5 43,15.5 T1.C | v41.5,27.5 51,27.5 X1.1 | FTDI.3 83,70 82.5,69.5 v71.5,69.5 49,69.5 VR3.VOUT 48.5,69.5 48,70 15.5,70 9,76.5 U$1.+3.3V | 1WR.4 1WR.3 11,81 15,77 16,77 U$1.REF_MSP 16.5,77 16.5,78 20.5,82 R6.2 | TMP1.P$3 23,2 15.5,9.5 15.5,15 9,15 8.5,14.5 6.5,14.5 2.5,18.5 2.5,26.5 TMP4.P$3 2.5,27 11.5,36 v17.5,36 19.5,34 37,34 v37.5,33.5
  Bottom 0.152: 40,22.5 40,26.5 C6.1 40,27 40,27.5 | 40,27.5 40,31 C7.2 39.5,31.5 v37.5,33.5 | T1.C 40,18.5 40,22.5 | 40,22.5 C5.1 | v65,12 75,2 JP2.10 | 40,27.5 v41.5,27.5 | 71.5,76.5 69.5,74.5 IC1.5 | 71.5,76.5 71.5,82.5 70.5,83.5 65,83.5 65,82.5 U$8.P$3 | 71.5,76.5 v71.5,69.5 71.5,65.5 60.5,65.5 58,63 58,59 TMP2.P$3 | PCB1.P$4 8.5,62 8.5,63 7.5,64 4.5,64 GPS.2 4,64 3.5,64 3,64.5 3,67 4,67 GPS.5 4.5,67 7,67 7,75 8.5,76.5 U$1.+3.3V 9,77 11,79 1WR.3 | U1.5 20.5,66 20.5,70 R11.2 20,70.5 20,71 17.5,73.5 | 17.5,73.5 17.5,75.5 16.5,76.5 U$1.REF_MSP | 17.5,73.5 17.5,53.5 17,53 17,39.5 TMP3.4 17,39 18,38 18,37.5 TMP3.2 18,37 18,36.5 v17.5,36
CLK  (via drill 0.35)
  Top 0.152: v26.5,44 23,44 23,46.5 RADIO.12 | v61,75.5 60.5,75 v30,75
  Bottom 0.152: RFM22B.12 28,23 28,26 28.5,26.5 30.5,26.5 31,27 31,40.5 27,44.5 | 27,44.5 27,53 27.5,53.5 27.5,75 29,76.5 U$1.P10 29.5,76.5 29.5,75.5 v30,75 | 27,44.5 v26.5,44 | v61,75.5 67.5,82 U$8.P$4
CURRENT  (via drill 0.35)
  Top 0.152: v65,66.5 61.5,66.5 55.5,60.5 14,60.5 14,54 U$1.P21
  Bottom 0.152: IC1.1 69.5,71 69.5,69 R3.2 70,68.5 71,67.5 71,66 65.5,66 v65,66.5 65,68 66,69 C1.1
GND  (via drill 0.35)  (14 unrouted)
  Top 0.152: 57.5,21 57,20.5 57,18.5 72,18.5 73.5,20 VR2.GND | 57.5,21 58,21.5 58.5,21.5 59,21 60,21 60.5,20.5 VR1.GND | 26.5,30 22,30 H1.1 RADIO.P$1 21.5,26 H2.1 20,21.5 12,21.5 7,16.5 X2.3 7.5,16 8,15.5 16.5,15.5 16.5,14 RADIO.2 16.5,13.5 18.5,11.5 42,11.5 44,9.5 R10.1 44.5,9.5 70,9.5 77.5,2 JP2.11 78,2 79,3 M2.P$1 | 26.5,30 v29.5,30 38,30 | 38,30 51,30 X1.4 | 38,30 v38,29.5 | 57.5,21 56,22.5 36.5,22.5 35.5,21.5 35,21.5 26.5,30 | TMP1.P$1 18,2 9,11 X2.4 7,11 2.5,11 | X2.2 2.5,16 2.5,11.5 X2.5 2.5,11 | 2.5,11 M2.P$8 | 1WR.1 8.5,81.5 8.5,83.5 1WR.2 | U$1.GND 6,76.5 5.5,76.5 5.5,66 6.5,65 8.5,65 PCB1.P$1 9,64.5 21,64.5 v21.5,64 22.5,65 47,65 48.5,66.5 VR3.GND | M1.P$8 81.5,83.5 71.5,83.5 70.5,82.5 U$8.P$5 | 15.5,46 15,46.5 RADIO.16 | 15.5,46 v18,43.5 | 15.5,46 16,46 16.5,46.5 RADIO.15 17,47 18,48 27.5,48 28.5,47 RADIO.9 29,46.5 31.5,44 38.5,44 48,53.5 | R1.1 25,58 27.5,55.5 45,55.5 46.5,54 U$1.GND@2 47,53.5 48,53.5 | 48,53.5 TMP2.P$1
  Bottom 0.152: RFM22B.16 RFM22B.15 28,17 28,22 27.5,22.5 27.5,27.5 RFM22B.9 v29.5,30 | C5.2 38.5,22.5 38.5,26.5 C6.2 38,27 v38,29.5 38,31 C7.1 | M2.P$1 82.5,16.5 80.5,18.5 R4.1 | 7.5,15.5 RFM22B.2 | 7.5,15.5 7.5,16 X2.3 | X2.3 7,16.5 7,27 TMP4.P$1 2.5,32 10,39.5 10,63.5 9,64.5 PCB1.P$1 | 7.5,15.5 7.5,11.5 X2.4 | 7.5,15.5 X2.3 | v21.5,64 22.5,65 U1.3 | GPS.6 4.5,68 6,69.5 6,76.5 U$1.GND 6.5,77 6.5,78.5 | 6.5,78.5 6.5,79.5 8,81 1WR.1 | 6.5,78.5 M1.P$1 | 68.5,67.5 66.5,67.5 C1.2 | 68.5,67.5 69.5,67.5 R3.1 | 68.5,67.5 68.5,70 | 68.5,70 68.5,71 IC1.2 68.5,71.5 68.5,80.5 70,82 U$8.P$5 | M1.P$8 81.5,81.5 81.5,67 83,65.5 FTDI.1 | v18,43.5 18,40 18.5,39.5 TMP3.5 | R5.1 51,19 50.5,19.5 50.5,36.5 51,37 51,49.5 47,53.5 U$1.GND@2 47,54 47,65 48.5,66.5 VR3.GND | 68.5,70 59.5,70 59.5,65 56.5,62 56.5,54.5 57.5,53.5 TMP2.P$1
  other vias: 34,19 34,15.5 26,17.5 55,10.5 57.5,10.5 57,21.5 55.5,23 44.5,57.5 52,76.5 53.5,81 49,76.5 64,73.5 16.5,82.5 43,28.5
  pour Top: 0,0 0,85 85,85 85,62.5 59.5,62.5 59.5,22.5 85,22.5 85,0
  pour Bottom: 0,0 0,85 85,85 85,62.5 59.5,62.5 59.5,22.5 85,22.5 85,0
GPS_RX  (via drill 0.35)
  Top 0.152: v13,75.5 29.5,75.5 30,76 30.5,76 31,75.5 35.5,75.5 36.5,76.5 U$1.P13
  Bottom 0.152: v13,75.5 7.5,70 7.5,65 4.5,65 GPS.3
GPS_SHDN  (via drill 0.35)
  Top 0.152: v34,63 v7.5,63
  Bottom 0.152: v7.5,63 4.5,63 GPS.1 | v34,63 36.5,65.5 36.5,74 39,76.5 U$1.P14
GPS_TX  (via drill 0.35)
  Top 0.152: v34,66 v6.5,66
  Bottom 0.152: v6.5,66 4.5,66 GPS.4 | v34,66 34,76.5 U$1.P12
HEATER  (via drill 0.35)
  Top 0.152: v58.5,12 57,13.5 42.5,13.5 40.5,15.5 T1.B
  Bottom 0.152: T1.B 40.5,15.5 42.5,13.5 44,13.5 44,30.5 41,33.5 41,49.5 37,53.5 U$1.P30 | v58.5,12 58.5,3 59.5,2 JP2.4
MANUAL_SAFEMODE
  Top 0.152: M2.P$6 39,38 45,32 50,32 51,31 X1.5
  Bottom 0.152: M2.P$6 34,41.5 34,53.5 U$1.P29
MISO  (via drill 0.35)
  Top 0.152: v28.5,44.5 26.5,46.5 RADIO.10 | v32,73 60.5,73 61.5,72 71,72 v72.5,73.5
  Bottom 0.152: RFM22B.10 31.5,25.5 31.5,41.5 v28.5,44.5 32.5,48.5 32.5,73 | 32.5,73 32.5,78.5 28,78.5 26.5,77 U$1.P9 | v72.5,73.5 72.5,82 U$8.P$6 | 32.5,73 v32,73
MOSI  (via drill 0.35)
  Top 0.152: v25.5,45 25,45 25,46.5 RADIO.11 | v26.5,79.5 27,79 59,79 62,82 U$8.P$2
  Bottom 0.152: RFM22B.11 32.5,20.5 32.5,14.5 30.5,12.5 27.5,12.5 27.5,22 25.5,24 v25.5,45 25,45.5 25,75.5 24,76.5 U$1.P8 24,77 v26.5,79.5
N$1  (via drill 0.35)
  Top 0.152: 21.5,58 22.5,58 R1.2 | 21.5,58 20,58 R7.1 | v21.5,56 21.5,58
  Bottom 0.152: v21.5,56 21.5,54 U$1.P24
N$2
  Bottom 0.152: R10.2 37,9.5 37.5,10 37.5,15.5 T1.E
N$3  (via drill 0.35)
  Top 0.152: v34,80 33.5,80 31.5,82 D2.K | v35.5,74 36,74.5 81.5,74.5 83,73 FTDI.4
  Bottom 0.152: v34,80 35.5,78.5 v35.5,74
RADIO_NIRQ  (via drill 0.35)
  Top 0.152: v55,42.5 v24.5,42.5 19,42.5 19,46.5 RADIO.14 | v55,44.5 56.5,46 NIRQ.1 | v31,18.5 26.5,23 v25.5,23
  Bottom 0.152: v55,44.5 v55,42.5 | RFM22B.14 31,17.5 v31,18.5 | v25.5,23 25,23.5 25,42 v24.5,42.5
RADIO_NSEL  (via drill 0.35)
  Top 0.152: NSEL.1 55.5,44 54.5,43 26.5,43 26,43.5 21,43.5 21,46.5 RADIO.13 | v31.5,19.5 33,21 55,21 v55.5,21.5
  Bottom 0.152: v31.5,19.5 RFM22B.13 | v55.5,21.5 56.5,22.5 56.5,42.5 NSEL.1
RADIO_RXANT  (via drill 0.35)
  Top 0.152: v15,18.5 18.5,15 19.5,15 20.5,14 RADIO.4 20.5,13.5 22,12 v57.5,12
  Bottom 0.152: RFM22B.3 15,17.5 v15,18.5 | RXANT.1 58,22 59.5,20.5 59.5,17.5 57.5,15.5 v57.5,12
RADIO_SHDN  (via drill 0.35)
  Top 0.152: v39.5,17 40,17.5 v74.5,17.5
  Bottom 0.152: 69,18 74.5,18 | 74.5,18 77.5,18 80,20.5 R4.2 | 69,18 69,20 VR2.SHDN | v39.5,17 39.5,19.5 33,26 33,80.5 24.5,80.5 21.5,77.5 21.5,77 U$1.P7 | 74.5,18 v74.5,17.5 | 69,18 64,13 64,3 63,2 JP2.5
RADIO_TXANT  (via drill 0.35)
  Top 0.152: v12,18.5 14.5,16 16.5,16 18.5,14 RADIO.3 | TXANT.1 57.5,41.5 v15,41.5
  Bottom 0.152: v12,18.5 12,19.5 RFM22B.4 15,21 v15,41.5
RADIO_VCC  (via drill 0.35)
  Top 0.152: v12,20.5 13,19.5 17,19.5 21.5,15 | 21.5,15 22.5,14 RADIO.5 | 21.5,15 28.5,15 31.5,18 74,18 76,20 VR2.VOUT
  Bottom 0.152: RFM22B.5 12,21.5 v12,20.5
RAIL_SHDN  (via drill 0.35)
  Top 0.152: v53,20 55.5,20 VR1.SHDN | v21.5,74 23.5,72 v51,72 | v55,5.5 61.5,5.5 65,2 JP2.6
  Bottom 0.152: v21.5,74 19,76.5 U$1.P6 | v51,72 51.5,71.5 51.5,21 R5.2 51.5,20.5 53,20.5 v53,20 53,7.5 v55,5.5
REGULATED_BUS  (via drill 0.35)  (1 unrouted)
  Top 0.152: v60,72 v56,72 55,71 v19,71 | M2.P$7 v20,38 23.5,34.5 41.5,34.5 v44,32
  Bottom 0.152: 67.5,72 68,72.5 68,76.5 67.5,77 R2.1 | 67.5,72 67.5,71.5 IC1.3 67.5,72 | M1.P$4 40.5,82.5 44,79 48,79 R8.2 54.5,72 v56,72 | v60,72 67.5,72 | 20.5,65 20.5,61.5 R12.1 20.5,61 20,60.5 v20,38 | M2.P$4 46.5,4 46.5,29.5 v44,32 | v19,71 19.5,70.5 19.5,66 20.5,65 | 20.5,65 U1.4
SD_SELECT  (via drill 0.35)
  Top 0.152: v55,77.5 54.5,78 33,78 32,77 U$1.P11
  Bottom 0.152: v55,77.5 59.5,82 U$8.P$1
TMP1  (via drill 0.35)
  Top 0.152: v22.5,49 27,49 31.5,53.5 U$1.P28
  Bottom 0.152: v22.5,49 21,47.5 21,32.5 19,30.5 19,3.5 20.5,2 TMP1.P$2
TMP2
  Top 0.152: U$1.P22 16.5,54 16.5,59.5 54.5,59.5 57.5,56.5 TMP2.P$2
TMP3
  Bottom 0.152: TMP3.1 19,37.5 19,38 19.5,38.5 19.5,53 19,53.5 U$1.P23
TMP4  (via drill 0.35)
  Top 0.152: v15.5,51.5 27,51.5 29,53.5 U$1.P27 | v10.5,37 3,29.5 2.5,29.5 TMP4.P$2
  Bottom 0.152: v15.5,51.5 10.5,46.5 v10.5,37
TO_CURRENT  (via drill 0.35)
  Top 0.152: v55.5,16.5 v59.5,16.5
  Bottom 0.152: 66.5,75.5 66.5,78.5 67,79 R2.2 | 66.5,75.5 67.5,74.5 IC1.4 | 56,70 59,70 59,72 62.5,75.5 66.5,75.5 | 56,70 54.5,70 R8.1 | v59.5,16.5 63,20 VR1.VOUT | v55.5,16.5 54.5,17.5 54.5,25 56,26.5 56,70

### Text on the board
tNames: 9DOF Top | Pololu 3.3V TOP | Pololu 3.3V TOP
bNames: Pololu 3.3VBot